# EAGLE design canSlaveV03_4s (EAGLE 6.3)

## Sheet 1 of 5
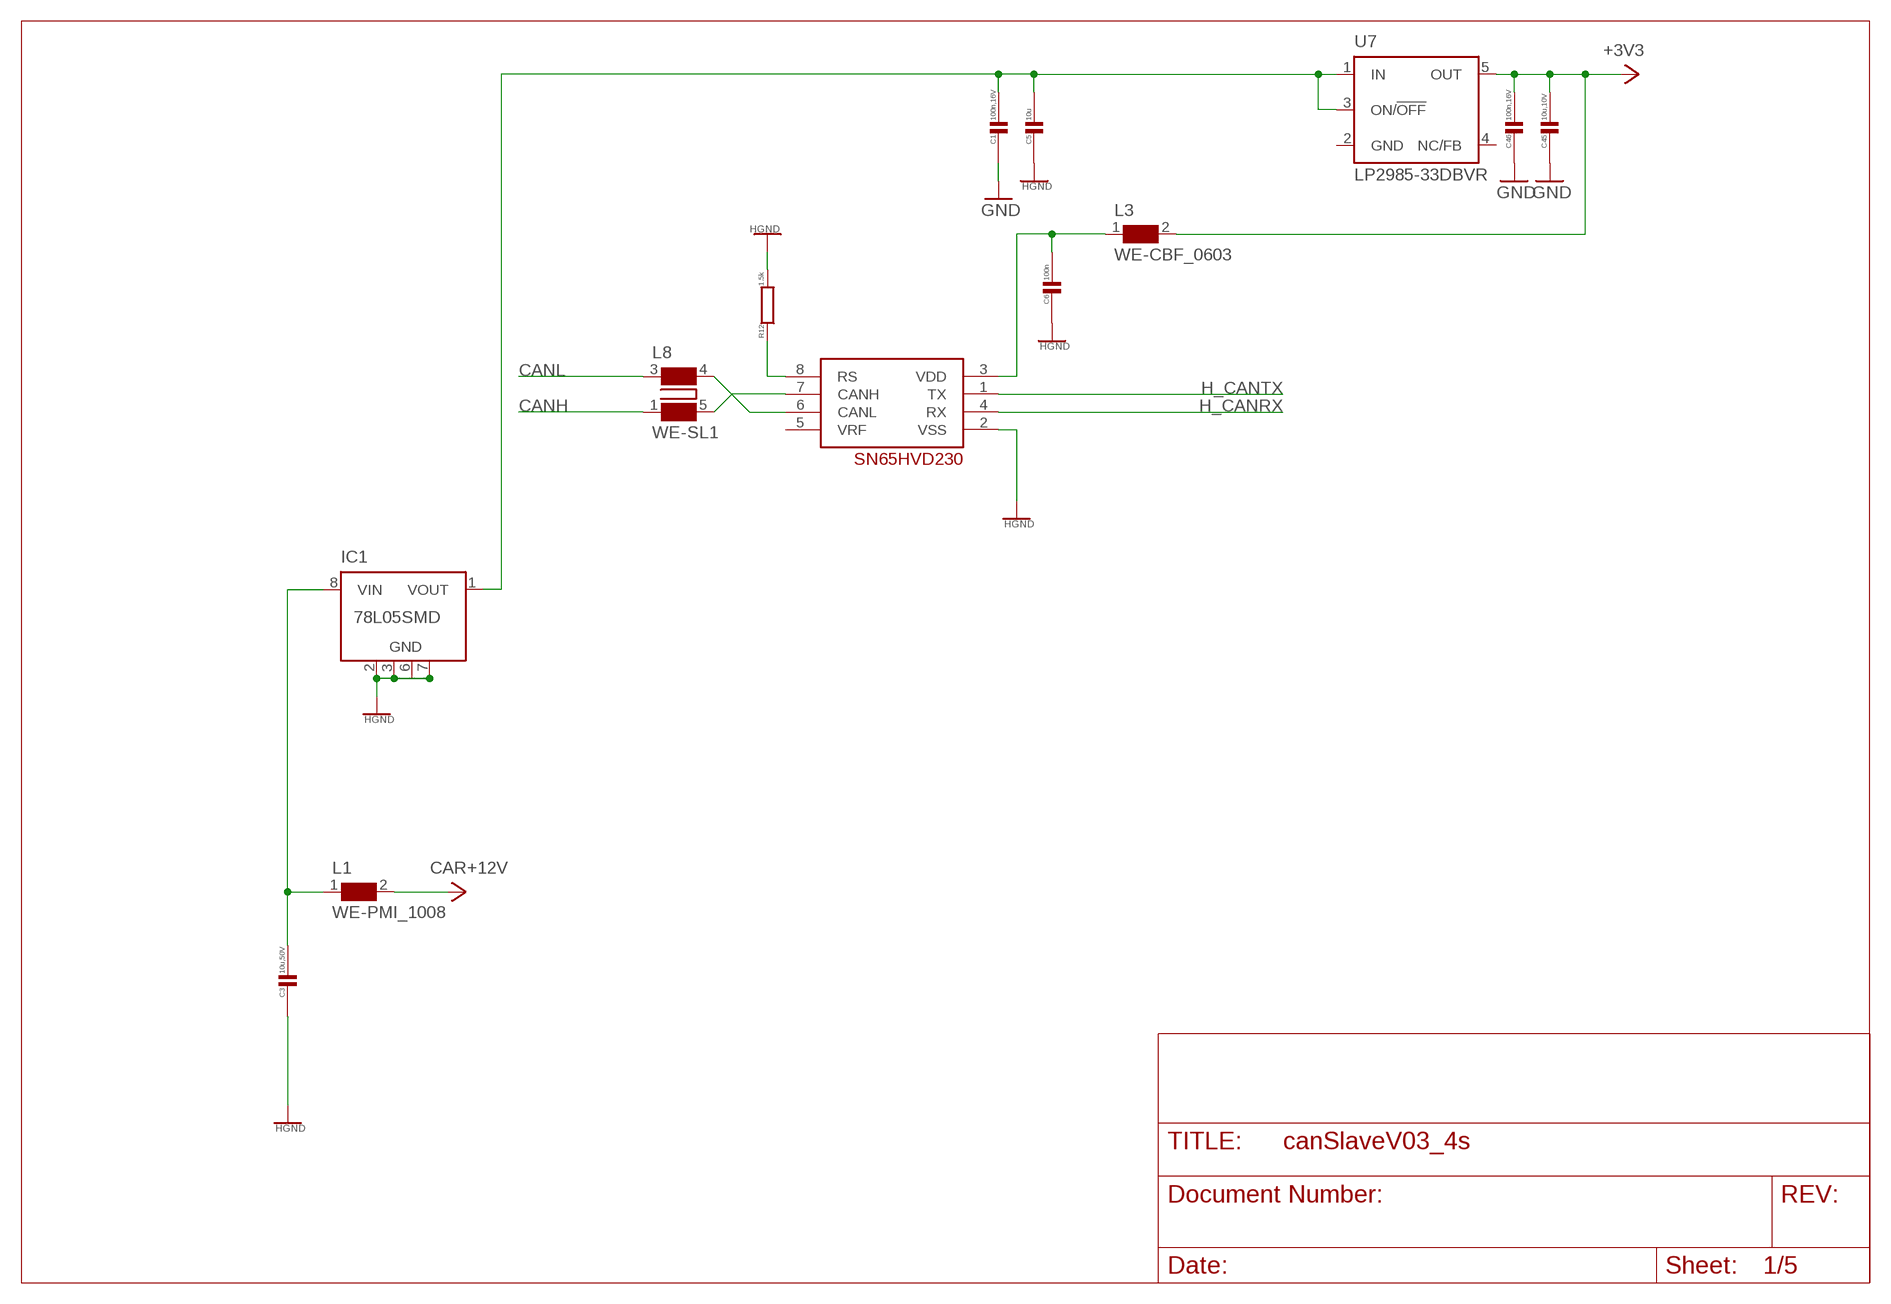
[diagram p0: schematic, sheet 1]

### Parts
C1  100n,16V  C0603  [C0603]
C3  10u,50V  C1206  [C1206]
C5  10u  C0603  [C0603]
C6  100n  C0603  [C0603]
C45  10u,10V  C0603  [C0603]
C46  100n,16V  C0603  [C0603]
IC1  78L05SMD  [SO08]
IC4  SN65HVD230  MCP2551  [SO-8]
L1  WE-PMI_1008  [WE-PMI_1008]
L3  WE-CBF_0603  [0603]
L8  WE-SL1  [WE-SL1]
R12  1.5k  R0603  [R0603]
U7  LP2985-33DBVR  LP2985-XXDBVR33  [SOT23-DBV]

### Nets
CANH: L8.1 ; also sheet 5
CANL: L8.3 ; also sheet 5
CAR+5V: C1.1 C5.1 IC1.1(VOUT) U7.1(IN) U7.3(ON/!OFF)
CAR+5V_H: C6.1 IC4.3(VDD) L3.1
CAR+12V: L1.2 ; also sheet 5
CAR+12VFILT: C3.1 IC1.8(VIN) L1.1
H+3V3: C45.1 C46.1 L3.2 U7.5(OUT) ; supply symbol labelled +3V3 ; also sheet 2,3,5
H_CANRX: IC4.4(RX) ; also sheet 2
H_CANTX: IC4.1(TX) ; also sheet 2
HCANHL: IC4.7(CANH) L8.5
HCANLL: IC4.6(CANL) L8.4
HGND: C1.2 C3.2 C5.2 C6.2 C45.2 C46.2 IC1.2(GND) IC1.3(GND) IC1.6(GND) IC1.7(GND) IC4.2(VSS) R12.2 ; supply symbol labelled GND ; also sheet 2,3,4,5
RS: IC4.8(RS) R12.1
Unconnected: IC1.4(NC) IC1.5(NC) IC4.5(VRF) U7.4(NC/FB)

## Sheet 2 of 5
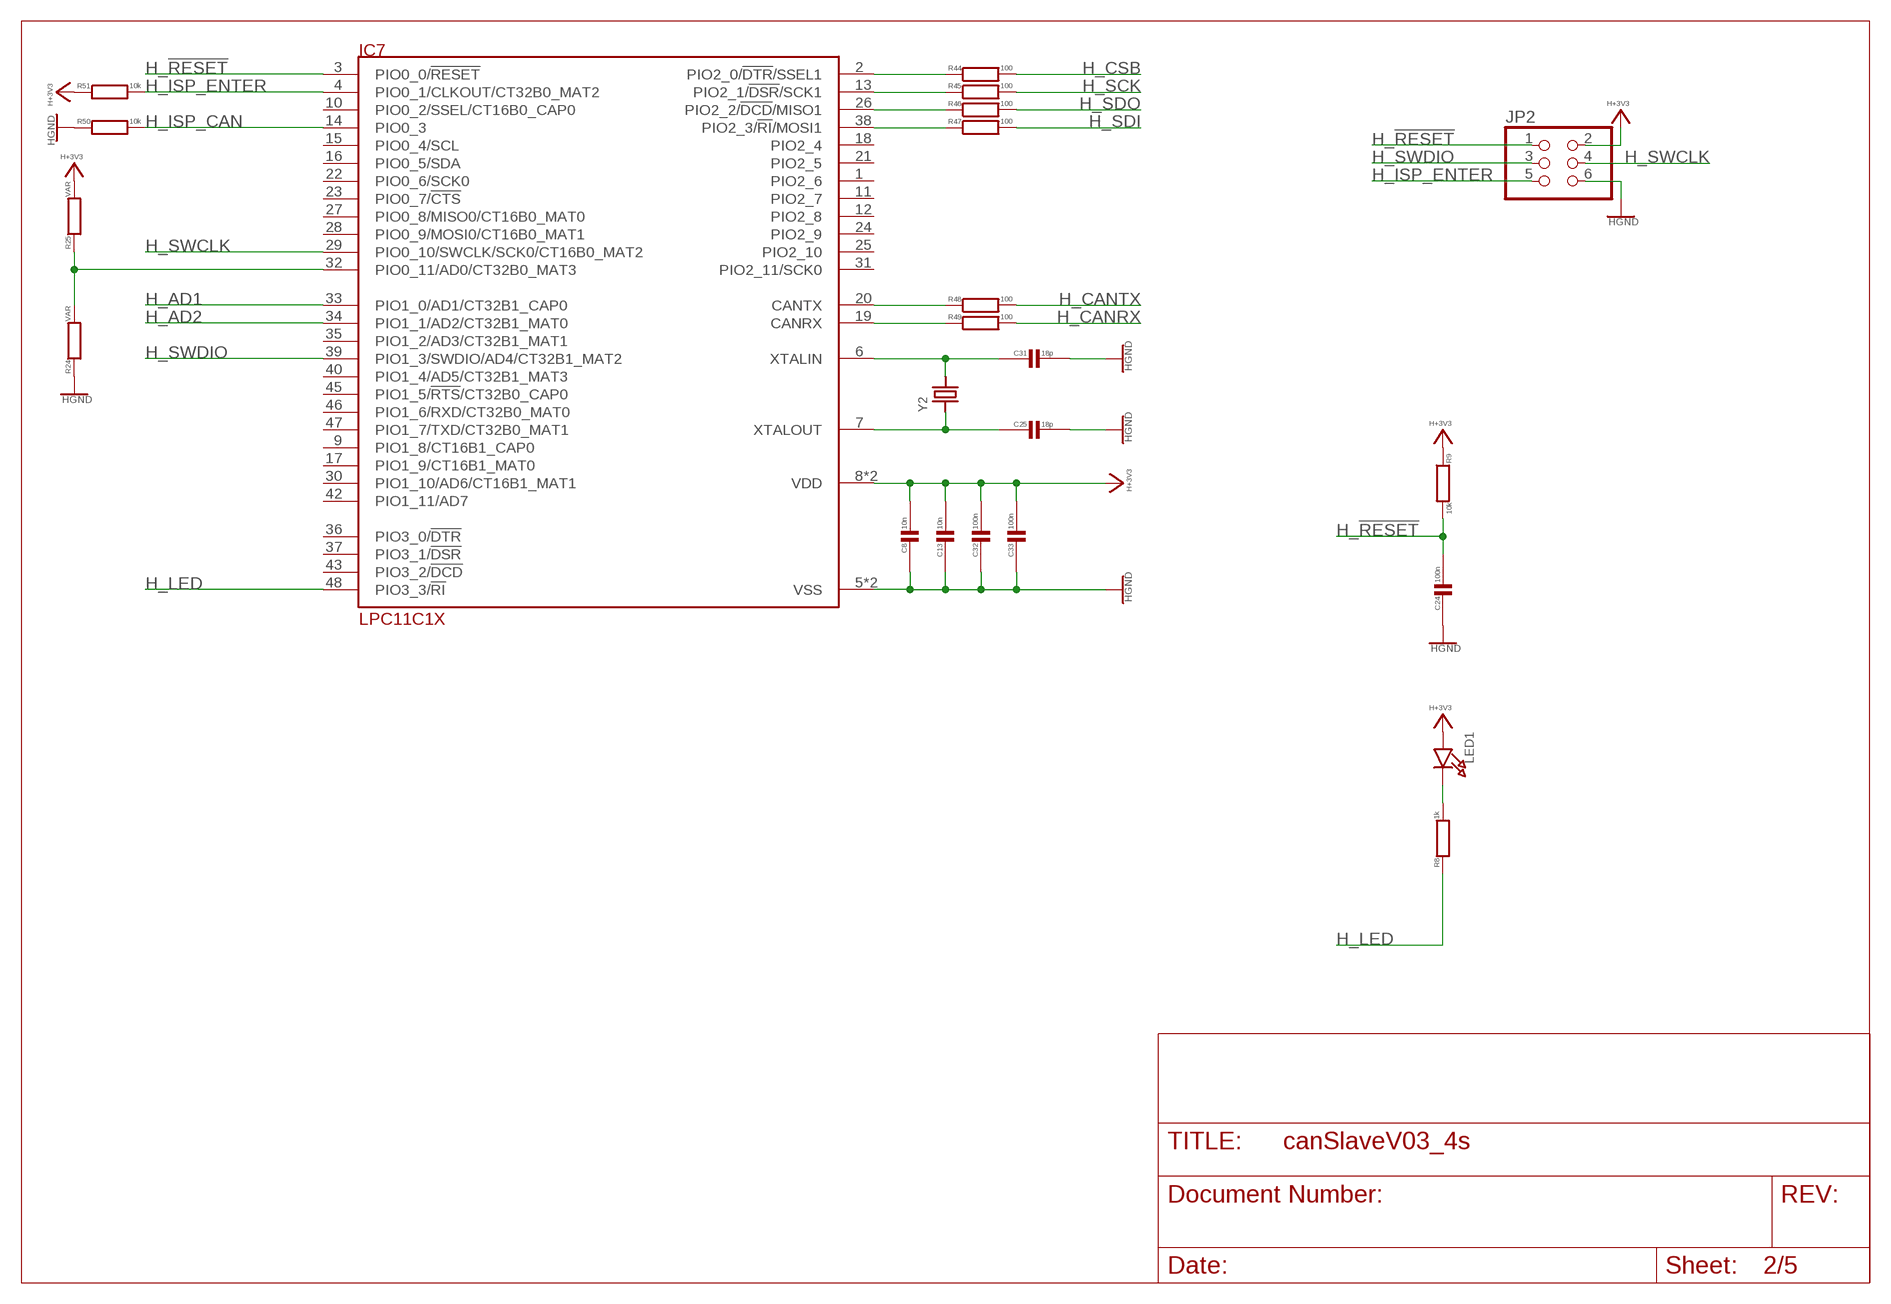
[diagram p1: schematic, sheet 2]

### Parts
C8  10n  C0603  [C0603]
C13  10n  C0603  [C0603]
C24  100n  C0603  [C0603]
C25  18p  C0603  [C0603]
C31  18p  C0603  [C0603]
C32  100n  C0603  [C0603]
C33  100n  C0603  [C0603]
IC7  LPC11C1X  [LQFP48]
JP2  HEADER-2X31.27  [2X03_1.27MM_SMT]
LED1  LED0603  [CHIPLED_0603]
R8  1k  R0603  [R0603]
R9  10k  R0603  [R0603]
R24  VAR  R0603  [R0603]
R25  VAR  R0603  [R0603]
R44  100  R0603  [R0603]
R45  100  R0603  [R0603]
R46  100  R0603  [R0603]
R47  100  R0603  [R0603]
R48  100  R0603  [R0603]
R49  100  R0603  [R0603]
R50  10k  R0603  [R0603]
R51  10k  R0603  [R0603]
Y2  CRYSTALTHIN  [CRYSTAL_3.2X2.5]

### Nets
CANRX_U_H: IC7.19(CANRX) R49.1
CANTX_U_H: IC7.20(CANTX) R48.1
H+3V3: C8.1 C13.1 C32.1 C33.1 IC7.8(VDD) IC7.44(VDD) JP2.2 LED1.A R9.1 R25.2 R51.1 ; also sheet 1,3,5
H_!RESET: C24.1 IC7.3(PIO0_0/!RESET) JP2.1 R9.2
H_AD1: IC7.33(PIO1_0/AD1/CT32B1_CAP0) ; also sheet 5
H_AD2: IC7.34(PIO1_1/AD2/CT32B1_MAT0)
H_ADR: IC7.32(PIO0_11/AD0/CT32B0_MAT3) R24.2 R25.1
H_CANRX: R49.2 ; also sheet 1
H_CANTX: R48.2 ; also sheet 1
H_CSB: R44.2 ; also sheet 3
H_ISP_CAN: IC7.14(PIO0_3) R50.2
H_ISP_ENTER: IC7.4(PIO0_1/CLKOUT/CT32B0_MAT2) JP2.5 R51.2
H_LED: IC7.48(PIO3_3/!RI) R8.1
H_MISO: IC7.26(PIO2_2/!DCD!/MISO1) R46.1
H_MOSI: IC7.38(PIO2_3/!RI!/MOSI1) R47.1
H_SCK: R45.2 ; also sheet 3
H_SCK1: IC7.13(PIO2_1/!DSR!/SCK1) R45.1
H_SDI: R47.2 ; also sheet 3
H_SDO: R46.2 ; also sheet 3
H_SSEL: IC7.2(PIO2_0/!DTR!/SSEL1) R44.1
H_SWCLK: IC7.29(PIO0_10/SWCLK/SCK0/CT16B0_MAT2) JP2.4
H_SWDIO: IC7.39(PIO1_3/SWDIO/AD4/CT32B1_MAT2) JP2.3
HGND: C8.2 C13.2 C24.2 C25.1 C31.1 C32.2 C33.2 IC7.5(VSS) IC7.41(VSS) JP2.6 R24.1 R50.1 ; also sheet 1,3,4,5
LED1C1: LED1.C R8.2
XTALIN1: C31.2 IC7.6(XTALIN) Y2.2
XTALOUT1: C25.2 IC7.7(XTALOUT) Y2.1
Unconnected: IC7.1(PIO2_6) IC7.9(PIO1_8/CT16B1_CAP0) IC7.10(PIO0_2/SSEL/CT16B0_CAP0) IC7.11(PIO2_7) IC7.12(PIO2_8) IC7.15(PIO0_4/SCL) IC7.16(PIO0_5/SDA) IC7.17(PIO1_9/CT16B1_MAT0) IC7.18(PIO2_4) IC7.21(PIO2_5) IC7.22(PIO0_6/SCK0) IC7.23(PIO0_7/!CTS) IC7.24(PIO2_9) IC7.25(PIO2_10) IC7.27(PIO0_8/MISO0/CT16B0_MAT0) IC7.28(PIO0_9/MOSI0/CT16B0_MAT1) IC7.30(PIO1_10/AD6/CT16B1_MAT1) IC7.31(PIO2_11/SCK0) IC7.35(PIO1_2/AD3/CT32B1_MAT1) IC7.36(PIO3_0/!DTR) IC7.37(PIO3_1/!DSR) IC7.40(PIO1_4/AD5/CT32B1_MAT3) IC7.42(PIO1_11/AD7) IC7.43(PIO3_2/!DCD) IC7.45(PIO1_5/!RTS!/CT32B0_CAP0) IC7.46(PIO1_6/RXD/CT32B0_MAT0) IC7.47(PIO1_7/TXD/CT32B0_MAT1)

## Sheet 3 of 5
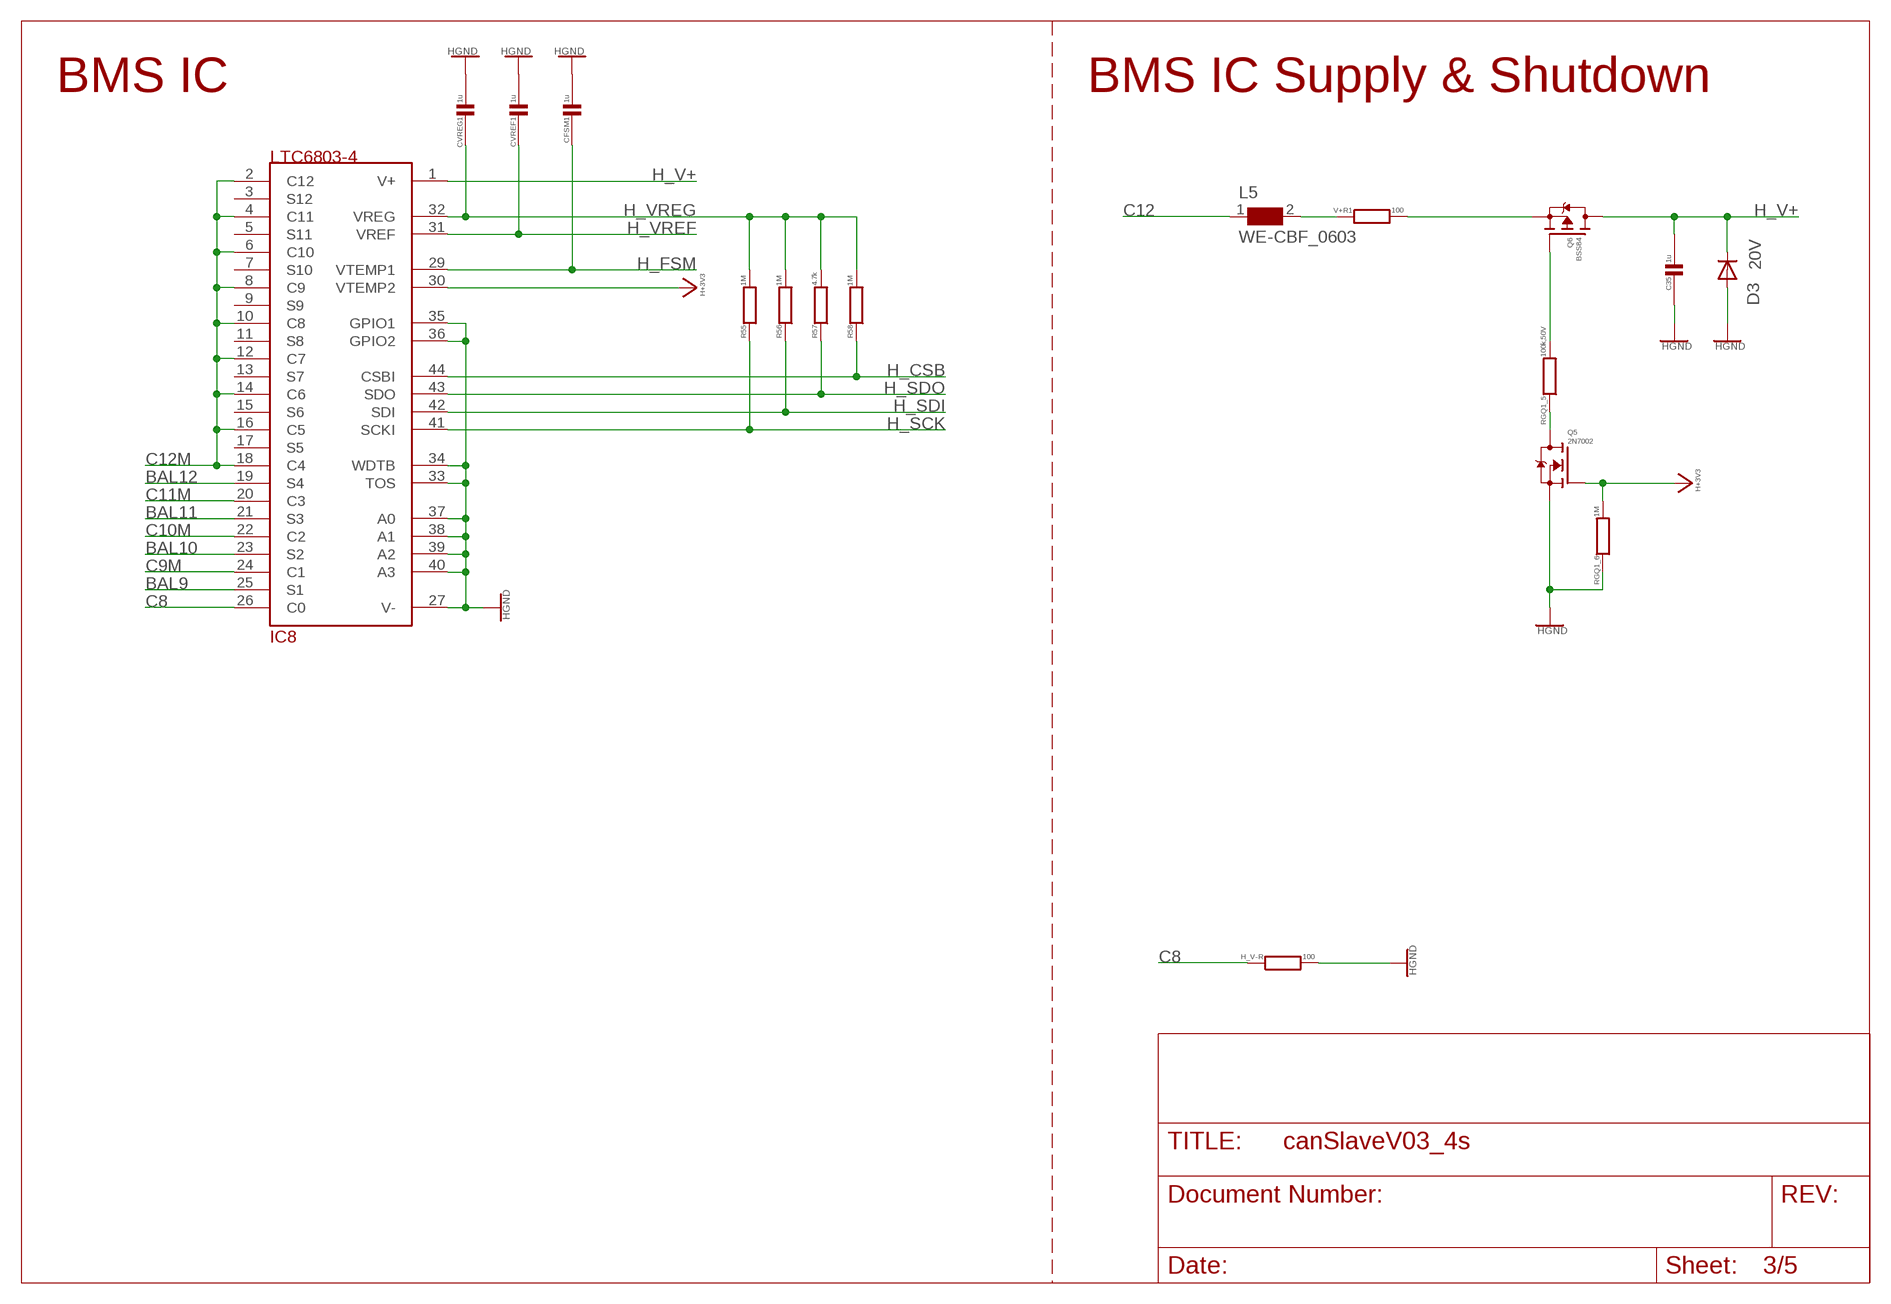
[diagram p2: schematic, sheet 3]

### Parts
C35  1u  C0603  [C0603]
CFSM1  1u  C0603  [C0603]
CVREF1  1u  C0603  [C0603]
CVREG1  1u  C0603  [C0603]
D3  20V  DIODE-SOD323-R  [SOD323-R]
H_V-R  100  R0603  [R0603]
IC8  LTC6803-4  [44SSOP]
L5  WE-CBF_0603  [0603]
Q5  2N7002  [SOT23]
Q6  BSS84  [SOT23]
R55  1M  R0603  [R0603]
R56  1M  R0603  [R0603]
R57  4.7k  R0603  [R0603]
R58  1M  R0603  [R0603]
RGQ1_5  100k,50V  R0603  [R0603]
RGQ1_6  1M  R0603  [R0603]
V+R1  100  R0603  [R0603]

### Nets
BAL9: IC8.25(S1) ; also sheet 4
BAL10: IC8.23(S2) ; also sheet 4
BAL11: IC8.21(S3) ; also sheet 4
BAL12: IC8.19(S4) ; also sheet 4
C8: H_V-R.1 IC8.26(C0) ; also sheet 4,5
C9M: IC8.24(C1) ; also sheet 4
C10M: IC8.22(C2) ; also sheet 4
C11M: IC8.20(C3) ; also sheet 4
C12: L5.1 ; also sheet 4,5
C12M: IC8.2(C12) IC8.4(C11) IC8.6(C10) IC8.8(C9) IC8.10(C8) IC8.12(C7) IC8.14(C6) IC8.16(C5) IC8.18(C4) ; also sheet 4
H+3V3: IC8.30(VTEMP2) Q5.1(G) RGQ1_6.2 ; also sheet 1,2,5
H_CSB: IC8.44(CSBI) R58.1 ; also sheet 2
H_FSM: CFSM1.2 IC8.29(VTEMP1) ; also sheet 5
H_SCK: IC8.41(SCKI) R55.1 ; also sheet 2
H_SDI: IC8.42(SDI) R56.1 ; also sheet 2
H_SDO: IC8.43(SDO) R57.1 ; also sheet 2
H_V+: C35.1 D3.C IC8.1(V+) Q6.3(D) ; also sheet 5
H_VREF: CVREF1.2 IC8.31(VREF)
H_VREG: CVREG1.2 IC8.32(VREG) R55.2 R56.2 R57.2 R58.2
HGND: C35.2 CFSM1.1 CVREF1.1 CVREG1.1 D3.A H_V-R.2 IC8.27(V-) IC8.33(TOS) IC8.34(WDTB) IC8.35(GPIO1) IC8.36(GPIO2) IC8.37(A0) IC8.38(A1) IC8.39(A2) IC8.40(A3) Q5.2(S) RGQ1_6.1 ; also sheet 1,2,4,5
N$5: Q5.3(D) RGQ1_5.1
N$6: L5.2 V+R1.1
Q1G1: Q6.1(G) RGQ1_5.2
V+S1: Q6.2(S) V+R1.2
Unconnected: IC8.3(S12) IC8.5(S11) IC8.7(S10) IC8.9(S9) IC8.11(S8) IC8.13(S7) IC8.15(S6) IC8.17(S5)

### Notes on the sheet
- BMS IC | BMS IC Supply & Shutdown

## Sheet 4 of 5
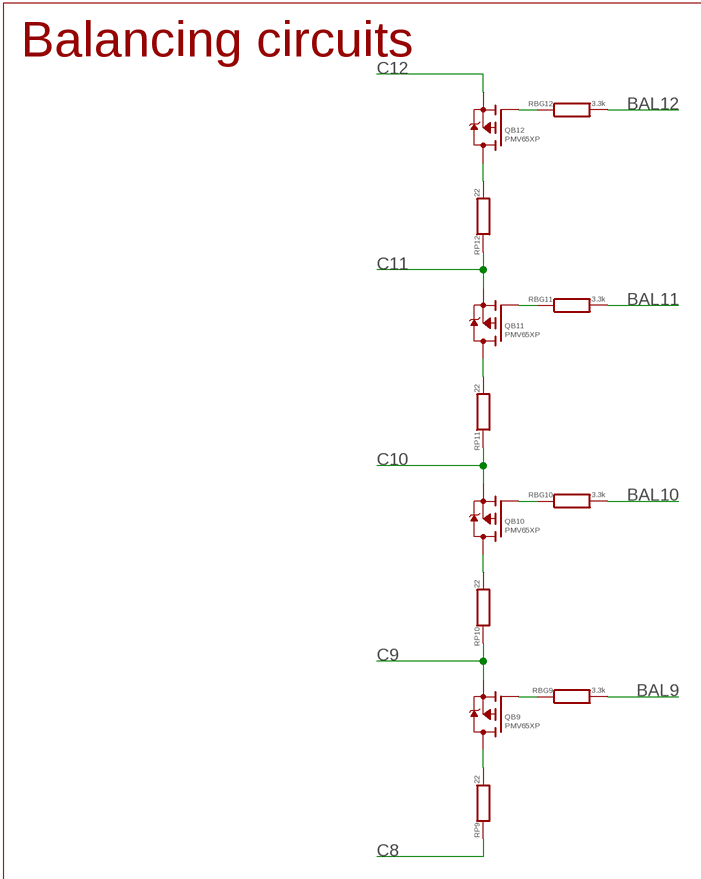
[diagram p3: schematic, sheet 4, part 1 of 2]
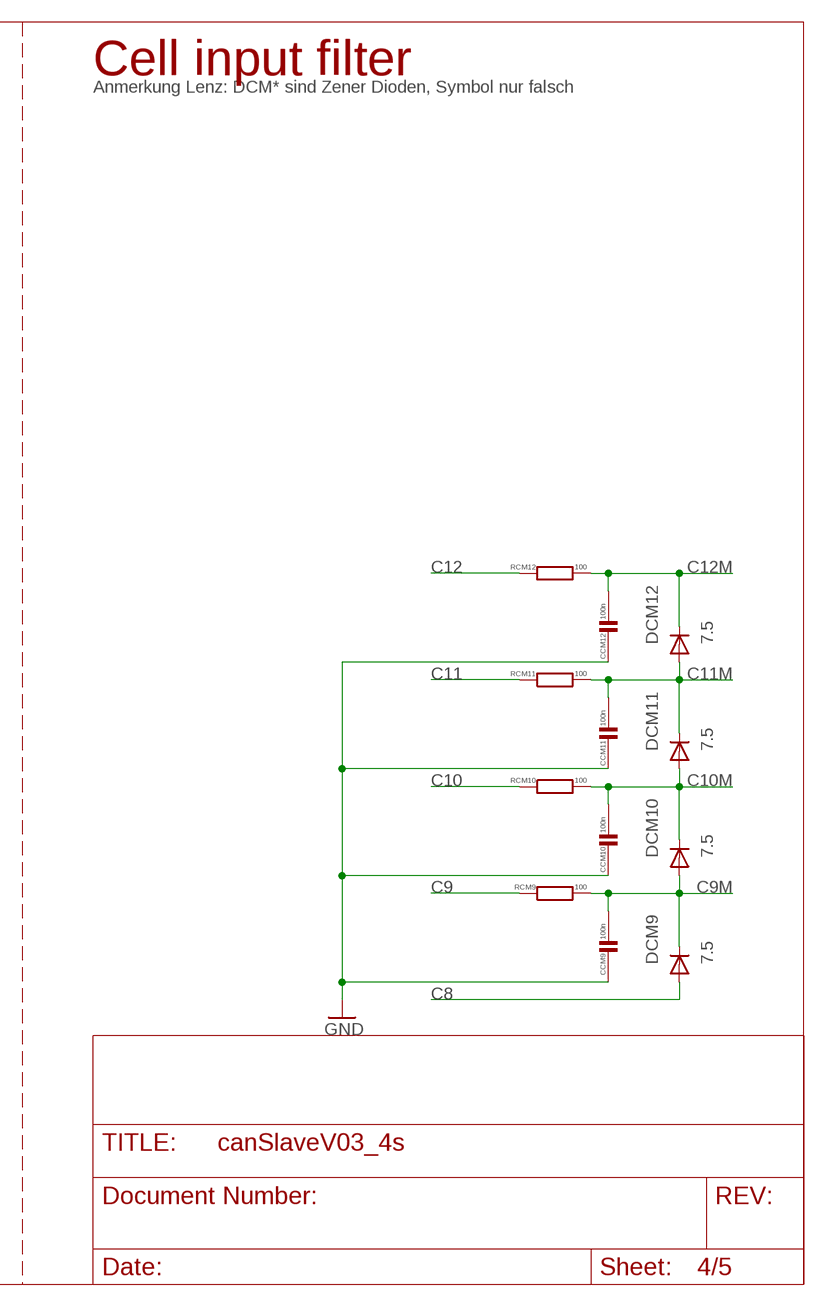
[diagram p4: schematic, sheet 4, part 2 of 2]

### Parts
CCM9  100n  C0603  [C0603]
CCM10  100n  C0603  [C0603]
CCM11  100n  C0603  [C0603]
CCM12  100n  C0603  [C0603]
DCM9  7.5  DIODE-SOD323-R  [SOD323-R]
DCM10  7.5  DIODE-SOD323-R  [SOD323-R]
DCM11  7.5  DIODE-SOD323-R  [SOD323-R]
DCM12  7.5  DIODE-SOD323-R  [SOD323-R]
QB9  PMV65XP  BSS84  [SOT23]
QB10  PMV65XP  BSS84  [SOT23]
QB11  PMV65XP  BSS84  [SOT23]
QB12  PMV65XP  BSS84  [SOT23]
RBG9  3.3k  R0603  [R0603]
RBG10  3.3k  R0603  [R0603]
RBG11  3.3k  R0603  [R0603]
RBG12  3.3k  R0603  [R0603]
RCM9  100  R0603  [R0603]
RCM10  100  R0603  [R0603]
RCM11  100  R0603  [R0603]
RCM12  100  R0603  [R0603]
RP9  22  R2512  [R2512]
RP10  22  R2512  [R2512]
RP11  22  R2512  [R2512]
RP12  22  R2512  [R2512]

### Nets
BAL9: RBG9.2 ; also sheet 3
BAL10: RBG10.2 ; also sheet 3
BAL11: RBG11.2 ; also sheet 3
BAL12: RBG12.2 ; also sheet 3
C8: DCM9.A RP9.1 ; also sheet 3,5
C9: QB9.2(S) RCM9.1 RP10.1 ; also sheet 5
C9M: CCM9.1 DCM9.C DCM10.A RCM9.2 ; also sheet 3
C10: QB10.2(S) RCM10.1 RP11.1 ; also sheet 5
C10M: CCM10.1 DCM10.C DCM11.A RCM10.2 ; also sheet 3
C11: QB11.2(S) RCM11.1 RP12.1 ; also sheet 5
C11M: CCM11.1 DCM11.C DCM12.A RCM11.2 ; also sheet 3
C12: QB12.2(S) RCM12.1 ; also sheet 3,5
C12M: CCM12.1 DCM12.C RCM12.2 ; also sheet 3
CR9: QB9.3(D) RP9.2
CR10: QB10.3(D) RP10.2
CR11: QB11.3(D) RP11.2
CR12: QB12.3(D) RP12.2
HGND: CCM9.2 CCM10.2 CCM11.2 CCM12.2 ; supply symbol labelled GND ; also sheet 1,2,3,5
QBG9: QB9.1(G) RBG9.1
QBG10: QB10.1(G) RBG10.1
QBG11: QB11.1(G) RBG11.1
QBG12: QB12.1(G) RBG12.1

### Notes on the sheet
- Balancing circuits | Cell input filter
- Anmerkung Lenz: DCM* sind Zener Dioden, Symbol nur falsch

## Sheet 5 of 5
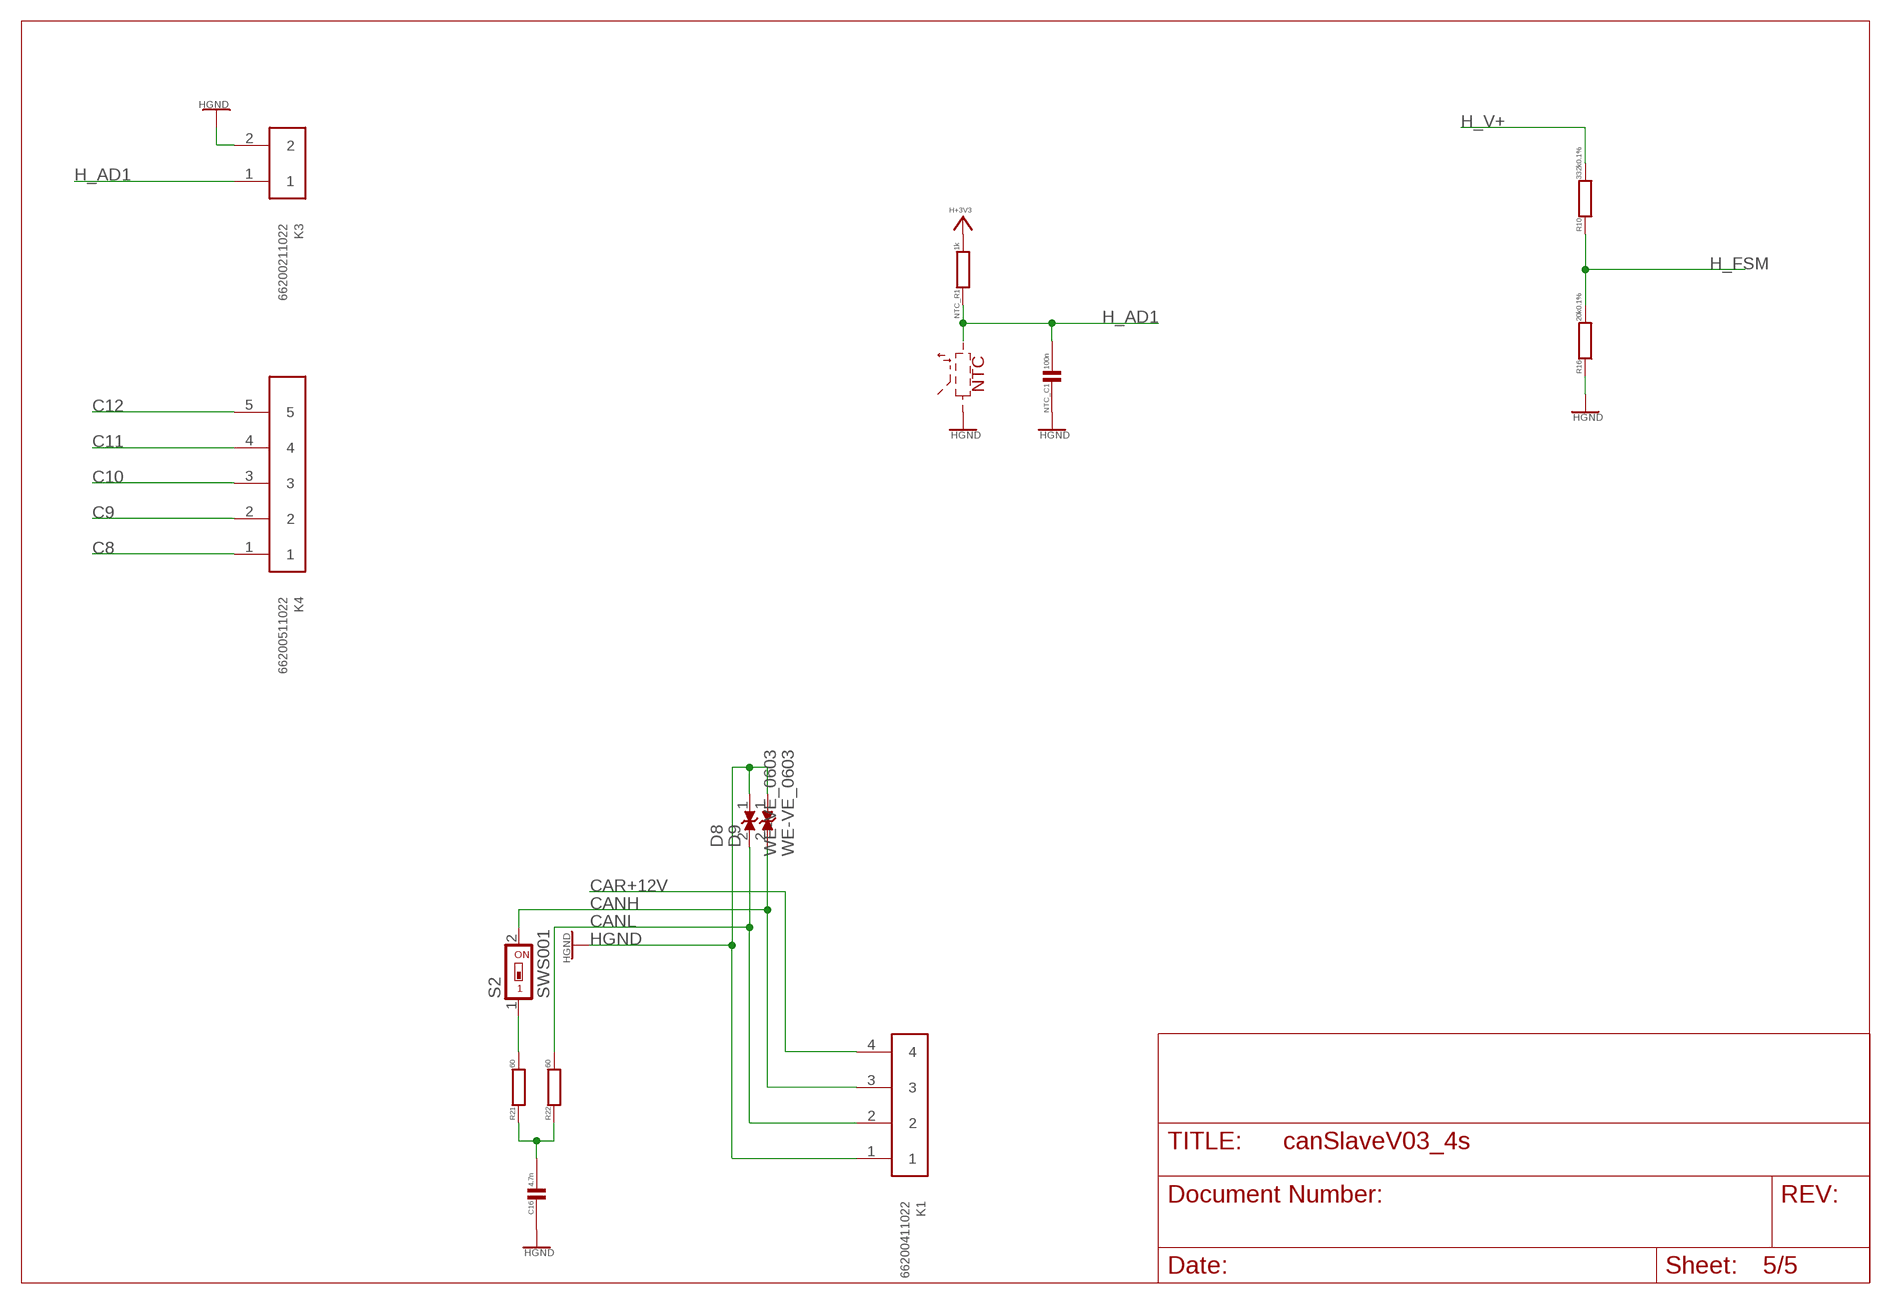
[diagram p5: schematic, sheet 5]

### Parts
C16  4.7n  C0603  [C0603]
D8  WE-VE_0603  [WESURGE_0603]
D9  WE-VE_0603  [WESURGE_0603]
K1  66200411022  [66200411022]
K3  66200211022  [66200211022]
K4  66200511022  [66200511022]
NTC_C1  100n  C0603  [C0603]
NTC_R1  1k  R0603  [R0603]
R10  332k0.1%  R0603  [R0603]
R16  20k0.1%  R0603  [R0603]
R21  60  R0603  [R0603]
R22  60  R0603  [R0603]
S2  SWS001  [SMS-001]

### Nets
C8: K4.1 ; also sheet 3,4
C9: K4.2 ; also sheet 4
C10: K4.3 ; also sheet 4
C11: K4.4 ; also sheet 4
C12: K4.5 ; also sheet 3,4
CANH: D9.2 K1.3 S2.2 ; also sheet 1
CANJ: R21.2 S2.1
CANL: D8.2 K1.2 R22.2 ; also sheet 1
CANT: C16.1 R21.1 R22.1
CAR+12V: K1.4 ; also sheet 1
H+3V3: NTC_R1.2 ; also sheet 1,2,3
H_AD1: K3.1 NTC_C1.1 NTC_R1.1 ; also sheet 2
H_FSM: R10.1 R16.2 ; also sheet 3
H_V+: R10.2 ; also sheet 3
HGND: C16.2 D8.1 D9.1 K1.1 K3.2 NTC_C1.2 R16.1 ; also sheet 1,2,3,4

### Notes on the sheet
- NTC

## Power pins joined to a net without a drawn wire
HGND: U7.2(GND)

## Library data of the parts
C1 C3 C5 C6 C8 C13 C16 C24 C25 C31-C33 C35 C45 C46 CCM9-CCM12 CFSM1 CVREF1 CVREG1 NTC_C1 = phrenetic:C
D3 DCM9-DCM12 = diode:DIODE-: DIODE
D8 D9 = EagleLibrary_Wuerth_Elektronik_eiSos_Version_6:WE-VE: WESURGE ESD Suppressor WE-VE - Fast response time - No leakage current - Low clamping voltage - Almost no energy consumption in stand-by mode - Excellent absorption for ESD-impulses - Designed to meet the EN 61000-4-2 standard - Nickel barrier - Operating temperature: -40°C to +85°C -- Protection of data lines -- Protection of bus system -- Protection of semiconductors -- ESD protection in accordance with EN 61000-4-2; 8 kV contact discharge / 15 kV air discharge
H_V-R NTC_R1 R8-R10 R12 R16 R21 R22 R24 R25 R44-R51 R55-R58 RBG9-RBG12 RCM9-RCM12 RGQ1_5 RGQ1_6 RP9-RP12 V+R1 = phrenetic:R: RESISTOR, Bla
IC1 = linear:78L*SMD: Positive VOLTAGE REGULATOR
IC4 = bms-hsrm:MCP2551
IC7 = phrenetic:LPC11C1X
IC8 = bms-hsrm:LTC6803-4
JP2 = microbuilder:HEADER-2X3: PIN HEADER
K1 = Wuerth_Elektronik_eiCan_08_Micro_Power_Connectors:66200411022: WR-MPC3 3.00mm Male Single Row Angled Header with Plastic Pegs, 4 Pins
K3 = Wuerth_Elektronik_eiCan_08_Micro_Power_Connectors:66200211022: WR-MPC3 3.00mm Male Single Row Angled Header with Plastic Pegs, 2 Pins
K4 = Wuerth_Elektronik_eiCan_08_Micro_Power_Connectors:66200511022: WR-MPC3 3.00mm Male Single Row Angled Header with Plastic Pegs, 5 Pins
L1 = EagleLibrary_Wuerth_Elektronik_eiSos_Version_6:WE-PMI: Power Multilayer Inductor WE-PMI - Compact multilayer type - Suitable for applocations with high currents up to 2.5 A - No crosstalk -- DC / DC converters especially at high switching frequencies -- Portable devices like PDA and digital cameras
L3 L5 = EagleLibrary_Wuerth_Elektronik_eiSos_Version_6:WE-CBF: SMD EMI Suppression Ferrite Beads WE-CBF - Excellent anti-EMI properties - Low DC-restistance - Impedances till 3000 ohms - Rated current up to 6 A -- Reliable Ni-Sn electrodes -- Perfect as data lined filter and for uncoupling of distribution voltage
L8 = EagleLibrary_Wuerth_Elektronik_eiSos_Version_6:WE-SL1: SMD Common Mode Line Filter WE-SL1 - Small size - Low Profile, only 1,65 mm - High Impedance up to 2000 ohm - High Current up to 300mA - Low leakage inductance -- USB -- CAN -- Firewire -- Data Lines -- Power Lines
LED1 = microbuilder:LED: LED 0603 - 0603 Surface Mount Package 2mA: Green LED - Low Power (3.9mcd, 2ma, 1.7Vf) - Digikey: 475-2709-2-ND Orange LED - Low Power (9.8mcd, 2ma, 1.8Vf) - Digikey: 475-1194-2-ND Red LED - Low Power (5mcd, 2ma, 1.8Vf) - Digikey: 475-1195-2-ND Yellow LED - Low Power (7mcd, 2ma, 1.8Vf) - Digikey: 475-1196-2-ND 5mA: Blue LED - Low Power (17mcd, 5ma, 2.9Vf) - Digikey: LNJ937W8CRACT-ND 0805 - 0805 Surface Mount Package 2mA: Red LED (8.8mcd, 2mA, 1.8Vf, Clear) - Low Power [Digikey: 475-2510-1-ND] Green LED (5mcd, 2mA, 1.8Vf, Clear) - Low Power [Digikey: 475-2730-1-ND] Yellow LED (11.3mcd, 2mA, 1.8Vf, Clear) - Low Power [Digikey: 475-2555-1-ND] 20mA: Red LED (104mcd, 20mA, Diffused) - LS R976 [Digikey: 475-1278-6-ND] Red LED (12mcd, 20mA, 2.0Vf, Clear) - APT2012EC [Digikey: 754-1128-1-ND] Green LED (15mcd, 20mA, 2.2Vf, Clear) - APT2012GC [Digikey: 754-1131-1-ND] Orange LED (160mcd, 20mA, 2.1Vf, Clear) - APT2012SECK [Digikey: 754-1130-1-ND] 1206 - 1206 Surface Mount Package Green LED (26mcd, 20mA, Diffused) - LG N971 [Digikey: 475-1407-6-ND] Red LED (15mcd, 20mA, Diffused) - LH N974 [Digikey: 475-1416-6-ND]
Q5 = phrenetic:2N7002
Q6 QB9-QB12 = phrenetic:BSS84
S2 = smd-special:SWS001: SMD Dip Switch 1 pol.
U7 = SmartPrj:LP2985-XXDBVR: ULTRALOW-POWER 50-mA LOW-DROPOUT LINEAR REGULATORS 50-mA Low-Dropout Regulator Source: http://focus.ti.com/lit/ds/symlink/tps77001.pdf
Y2 = microbuilder:CRYSTAL: Crystals HC49UP - Surface Mount Crystal 4.0MHz 18pF +/-30ppm Surface Mount Crystal [Digikey: 535-9857-1-ND] 12.0 MHz Surface Mount Crystal [Digikey: 535-9869-6-ND] 25.0 MHz Surface Mount Crystal [Digikey: 535-9078-1-ND] 2.5 x 2.0mm - MEMs SMT Crystal 16.0 MHz 10pF 20ppm 2.5 x 2.0mm Crystal [Digikey -40-85°C: 535-10923-1-ND] 3.2 x 2.5mm - MEMs SMT Crystal 12.0 MHz 8pF 15ppm 3.2 x 2.5mm Crystal [Digikey: -10-70°C: 644-1047-1-ND -40-125°C: 644-1128-1-ND] 16.0 MHz 8pF 15ppm 3.2 x 2.5mm Crystal [Digikey: -10-70°C: 644-1049-1-ND -40-125°C: 644-1129-2-ND] 16.0 MHz 10pF 10ppm 3.2 x 2.5mm Crystal [Digikey: 644-1100-1-ND] 27.12 MHz 18pF 30ppm 3.2 x 2.5mm Crystal [Digikey: 887-1424-1-ND] 27.12MHz 10pF 10ppm 3.2 x 2.5mm Crystal [Digikey: 887-1329-1-ND] 4.9 x 1.8mm - MEMs SMT Crystal 32.768 KHz 12.5pF 20ppm 4.9 x 1.8mm Crystal [Digikey: SE2415CT-ND] 8.0 x 3.8mm - Surface Mount Crystal 32.768kHz 12.5pF 20ppm -40°C-85°C [Digikey: 535-9166-2-ND] Cylinder 32.768KHz Cylinder Crystal (2x6mm body) [Ex. Digikey: 300-8341-2-ND]

## Board
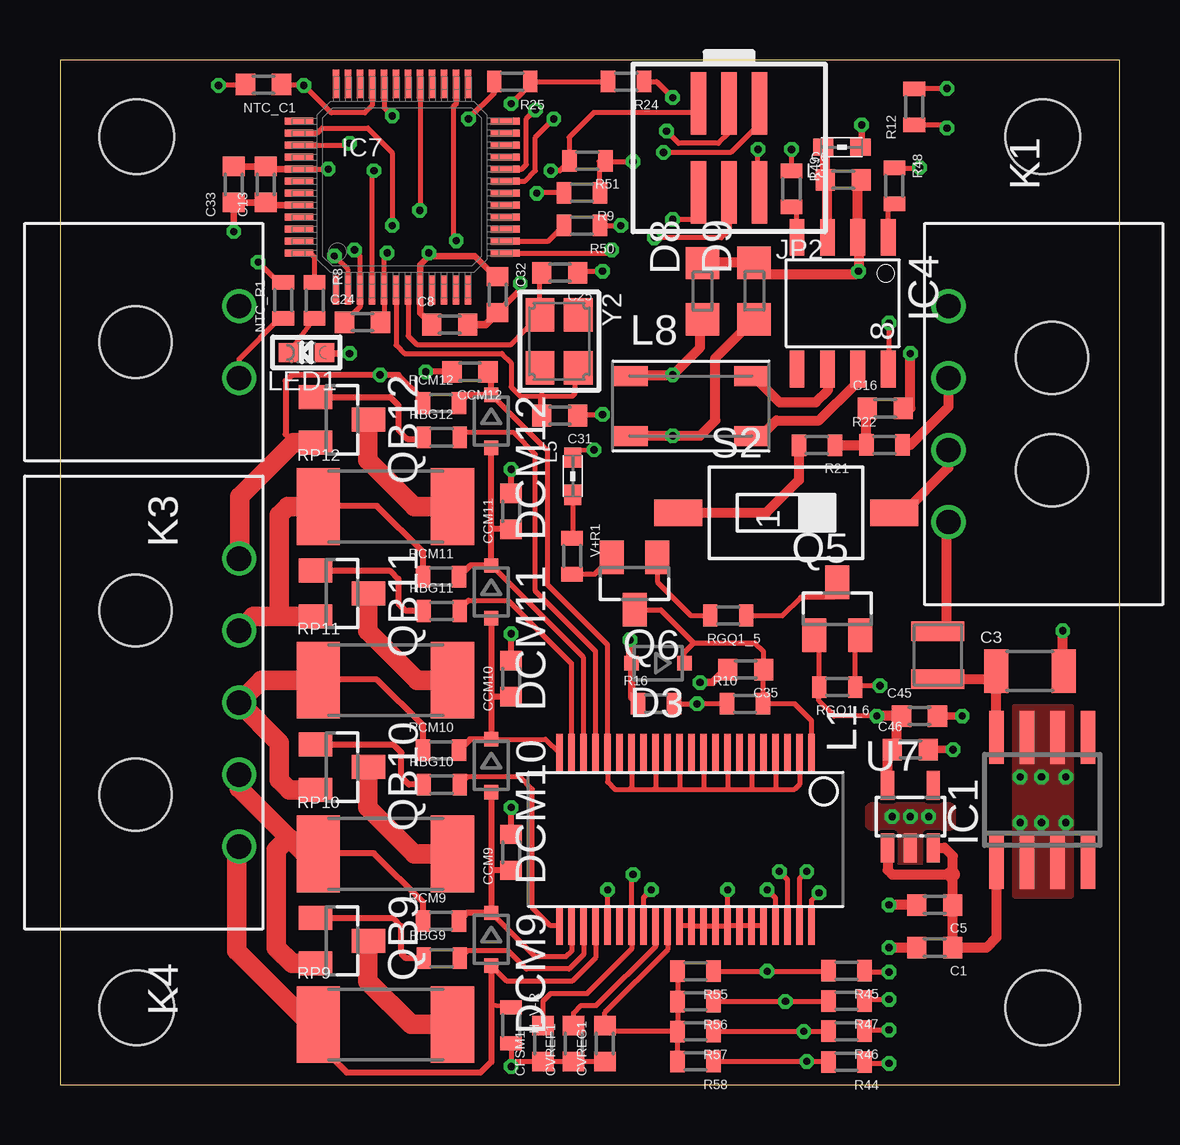
[diagram p6: board, top side]
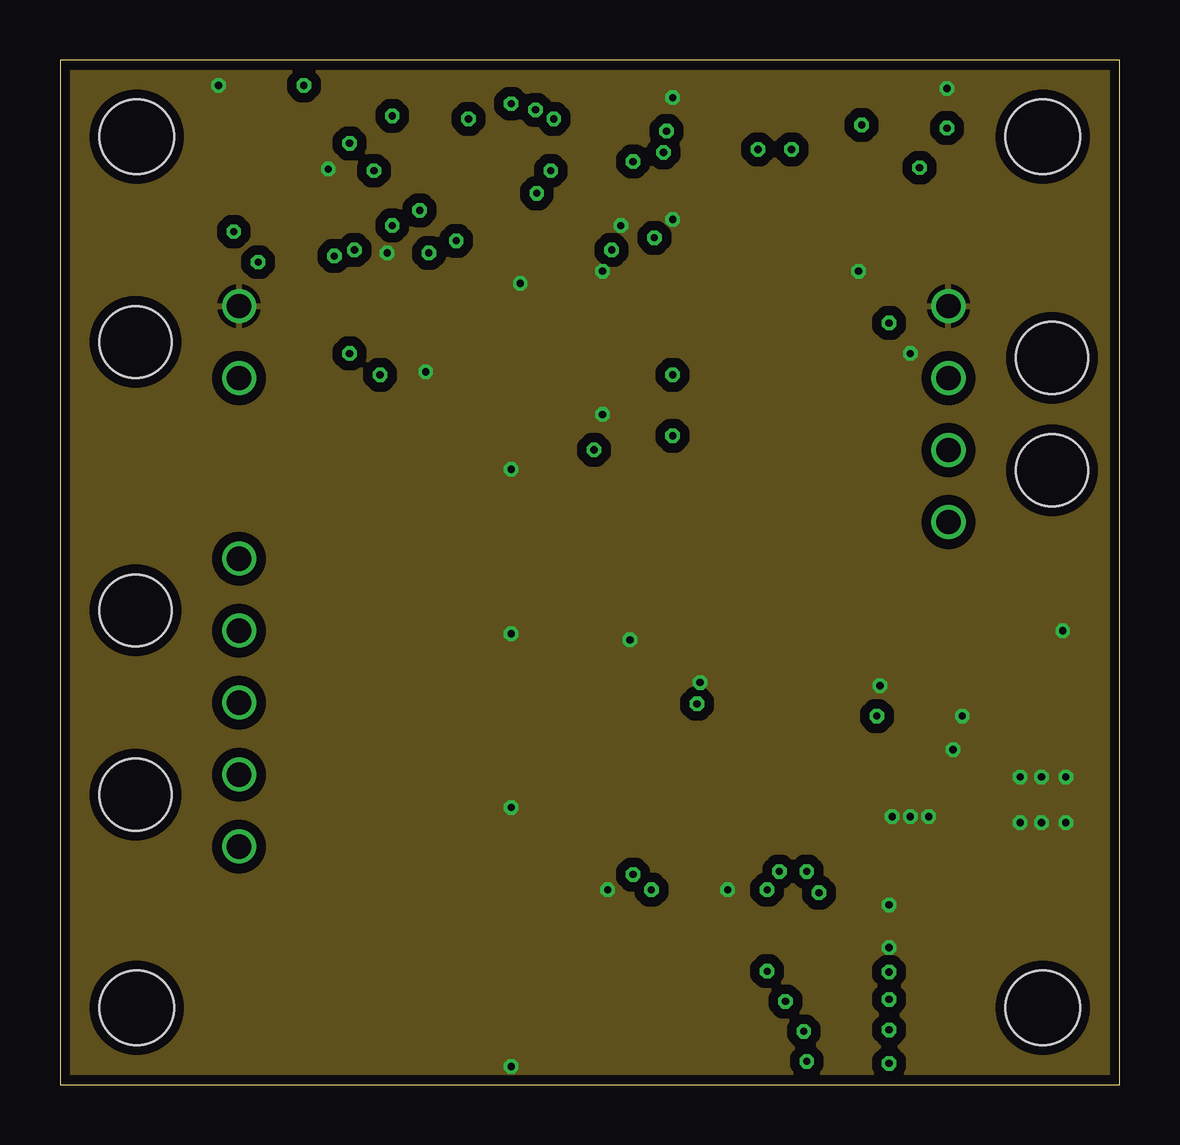
[diagram p7: board, inner layer Route2]
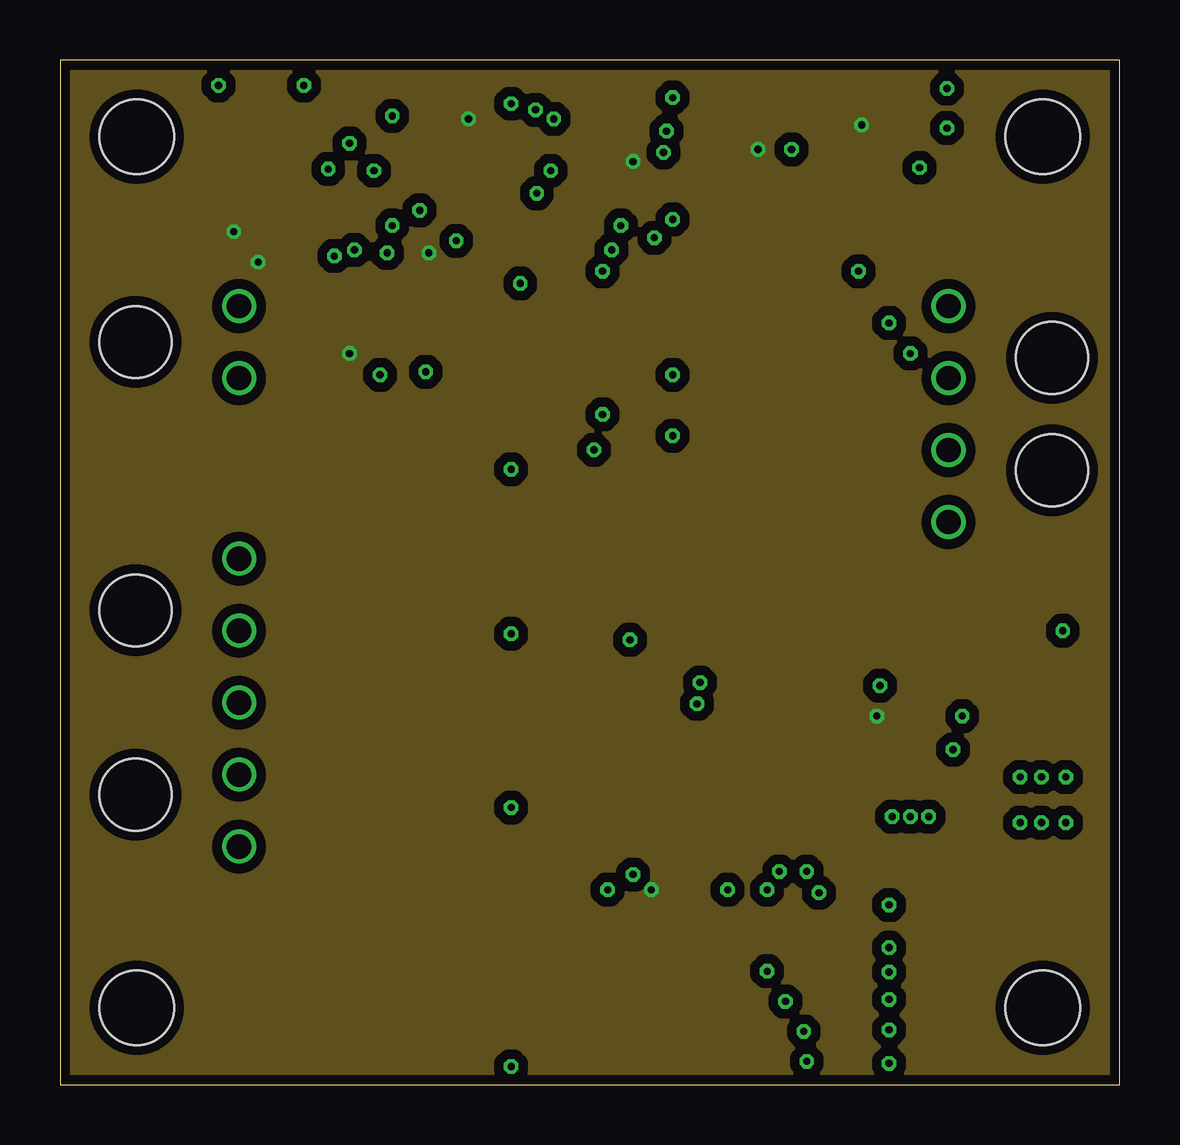
[diagram p8: board, inner layer Route15]
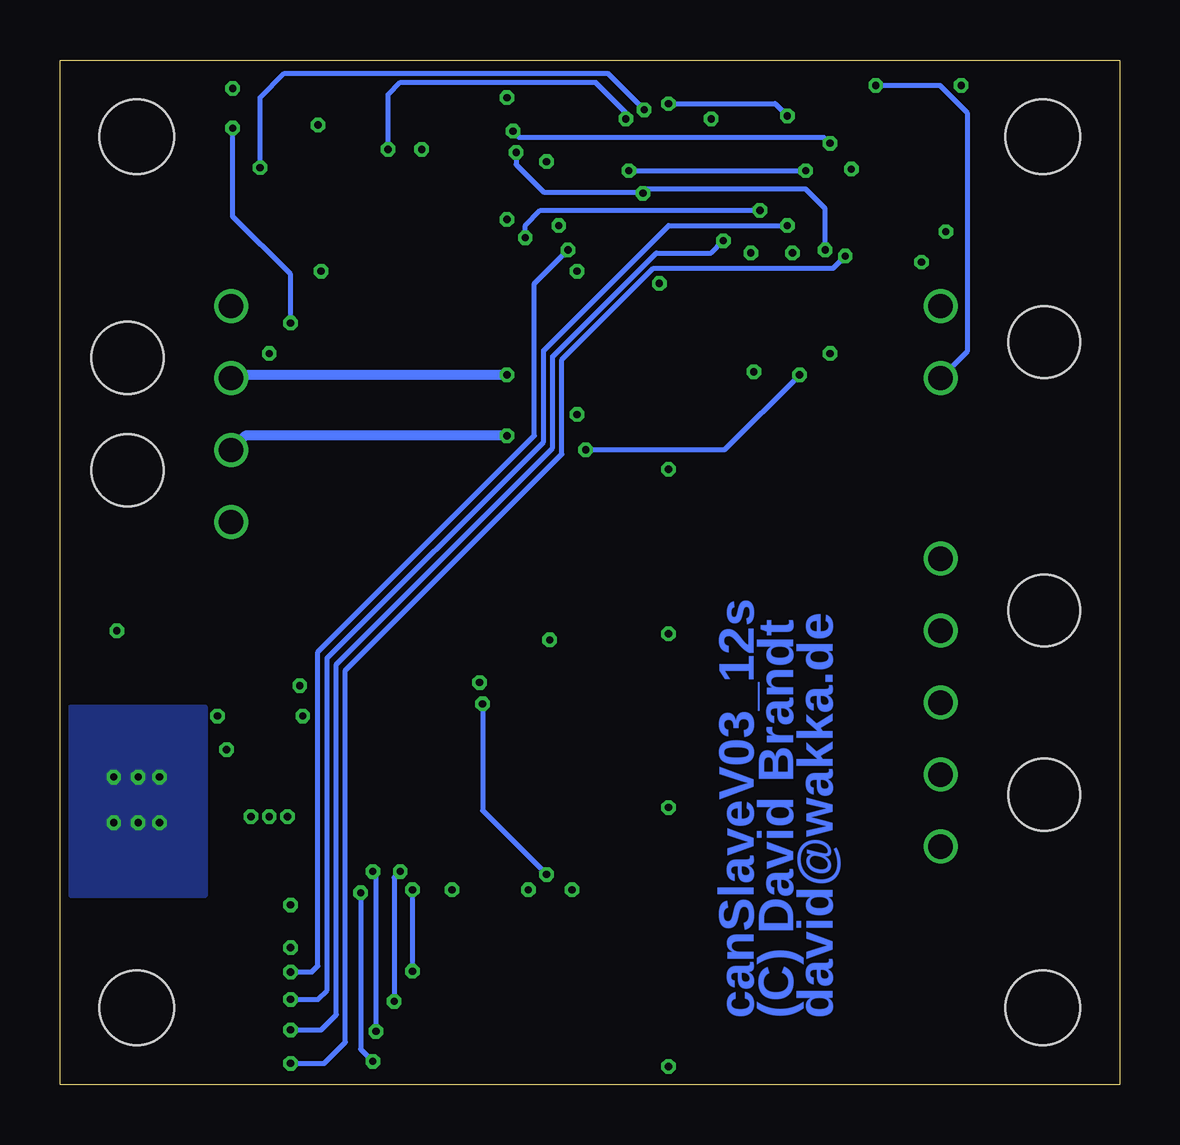
[diagram p9: board, bottom side, seen from below]

Size 44.15 x 42.72 mm. Coordinates in mm from the lower left corner, seen from the top.
Outline: 0,0 44.15,0 44.15,42.72 0,42.72 0,0
Copper layers (1+2*15+16): Top 0.035mm / dielectric 0.38mm / Route2 0.035mm / dielectric 0.71mm / Route15 0.035mm / dielectric 0.38mm / Bottom 0.035mm
Design rules "PCB-POOL Standard_ML4 *": minimum track width 8mil, minimum drill 0.3mm, track to track 0.15mm, track to pad 0.15mm, pad to pad 0.15mm, via to via 0.15mm, smd to smd 0.15mm, copper to edge 0.3mm, drill to drill 0.2mm, minimum pad ring 0.2mm, minimum via ring 0.15mm, stop-mask expansion 0.075mm, vias tented up to drill 0.41mm, thermal gap 0.2mm
Holes 3.1 mm at 3.2,3.2 3.2,39.52 40.95,3.2 40.95,39.52
tRestrict: area 0.2,0.2 to 6.2,6.2; area 0.2,36.5 to 6.2,42.5; area 38,0.2 to 44,6.2; area 38,36.5 to 44,42.5
bRestrict: area 0.2,0.2 to 6.2,6.2; area 0.2,36.5 to 6.2,42.5; area 38,0.2 to 44,6.2; area 38,36.5 to 44,42.5

### Footprints (pad centres in the part's own frame; a part is rotated, then mirrored left to right if it is on the bottom)
C0603 = smd 0.8 x 0.9: 1 -0.75,0; 2 0.75,0
C1206 = smd 1 x 1.8: 1 -1.4,0; 2 1.4,0
SOD323-R = smd 0.6 x 0.6: A 1.1,0; C -1.1,0
WESURGE_0603 = smd 1.35 x 1.4: 1 -1.175,0; 2 1.175,0
R0603 = smd 0.6 x 0.9: 1 -0.75,0; 2 0.75,0
SO08 = smd 0.6 x 2.2: 1 -1.905,-2.6; 2 -0.635,-2.6; 3 0.635,-2.6; 4 1.905,-2.6; 5 1.905,2.6; 6 0.635,2.6; 7 -0.635,2.6; 8 -1.905,2.6
SO-8 = smd 1.524 x 0.61: 1 -2.743,1.905; 2 -2.743,0.635; 3 -2.743,-0.635; 4 -2.743,-1.905; 5 2.743,-1.905; 6 2.743,-0.635; 7 2.743,0.635; 8 2.743,1.905
LQFP48 = smd 0.28 x 1.2: 1 -2.75,-4.3; 2 -2.25,-4.3; 3 -1.75,-4.3; 4 -1.25,-4.3; 5 -0.75,-4.3; 6 -0.25,-4.3; 7 0.25,-4.3; 8 0.75,-4.3; 9 1.25,-4.3; 10 1.75,-4.3; 11 2.25,-4.3; 12 2.75,-4.3; 25 2.75,4.3; 26 2.25,4.3; 27 1.75,4.3; 28 1.25,4.3; 29 0.75,4.3; 30 0.25,4.3; 31 -0.25,4.3; 32 -0.75,4.3; 33 -1.25,4.3; 34 -1.75,4.3; 35 -2.25,4.3; 36 -2.75,4.3 | smd 1.2 x 0.28: 13 4.3,-2.75; 14 4.3,-2.25; 15 4.3,-1.75; 16 4.3,-1.25; 17 4.3,-0.75; 18 4.3,-0.25; 19 4.3,0.25; 20 4.3,0.75; 21 4.3,1.25; 22 4.3,1.75; 23 4.3,2.25; 24 4.3,2.75; 37 -4.3,2.75; 38 -4.3,2.25; 39 -4.3,1.75; 40 -4.3,1.25; 41 -4.3,0.75; 42 -4.3,0.25; 43 -4.3,-0.25; 44 -4.3,-0.75; 45 -4.3,-1.25; 46 -4.3,-1.75; 47 -4.3,-2.25; 48 -4.3,-2.75
44SSOP = smd 1.6 x 0.28: 1 -3.6,5.25; 2 -3.6,4.75; 3 -3.6,4.25; 4 -3.6,3.75; 5 -3.6,3.25; 6 -3.6,2.75; 7 -3.6,2.25; 8 -3.6,1.75; 9 -3.6,1.25; 10 -3.6,0.75; 11 -3.6,0.25; 12 -3.6,-0.25; 13 -3.6,-0.75; 14 -3.6,-1.25; 15 -3.6,-1.75; 16 -3.6,-2.25; 17 -3.6,-2.75; 18 -3.6,-3.25; 19 -3.6,-3.75; 20 -3.6,-4.25; 21 -3.6,-4.75; 22 -3.6,-5.25; 23 3.6,-5.25; 24 3.6,-4.75; 25 3.6,-4.25; 26 3.6,-3.75; 27 3.6,-3.25; 28 3.6,-2.75; 29 3.6,-2.25; 30 3.6,-1.75; 31 3.6,-1.25; 32 3.6,-0.75; 33 3.6,-0.25; 34 3.6,0.25; 35 3.6,0.75; 36 3.6,1.25; 37 3.6,1.75; 38 3.6,2.25; 39 3.6,2.75; 40 3.6,3.25; 41 3.6,3.75; 42 3.6,4.25; 43 3.6,4.75; 44 3.6,5.25
2X03_1.27MM_SMT = smd 0.65 x 2.6: 1 -1.27,-1.85; 2 -1.27,1.85; 3 0,-1.85; 4 0,1.85; 5 1.27,-1.85; 6 1.27,1.85
66200411022 = drill 1.02: 1 1.5,0; 2 -1.5,0; 3 -4.5,0; 4 -7.5,0 | hole 3: -0.66,-4.32; -5.34,-4.32
66200211022 = drill 1.02: 1 1.5,0; 2 -1.5,0 | hole 3: 0,-4.32
66200511022 = drill 1.02: 1 1.5,0; 2 -1.5,0; 3 -4.5,0; 4 -7.5,0; 5 -10.5,0 | hole 3: -0.66,-4.32; -8.34,-4.32
WE-PMI_1008 = smd 0.8 x 2.2: 1 -1,0; 2 1,0
0603 = smd 0.85 x 0.7: 1 -0.775,0; 2 0.775,0
WE-SL1 = smd 1.5 x 0.85: 1 -2.55,-1.25; 3 -2.55,1.25; 4 2.55,1.25; 5 2.55,-1.25
CHIPLED_0603 = smd 0.8 x 0.8: A 0,-0.75; C 0,0.75
SOT23 = smd 1 x 1.4: 1 -0.95,-1.1; 2 0.95,-1.1; 3 0,1.1
R2512 = smd 1.8 x 3.2: 1 -2.8,0; 2 2.8,0
SMS-001 = smd 1.092 x 2.007: 1 0,-4.496; 2 0,4.496
SOT23-DBV = smd 0.55 x 1.2: 1 -0.95,-1.3; 2 0,-1.3; 3 0.95,-1.3; 4 0.95,1.3; 5 -0.95,1.3
CRYSTAL_3.2X2.5 = smd 1.4 x 1.2: 1 -1.1,-0.8; 2 1.1,0.8; GND1 -1.1,0.8; GND2 1.1,-0.8

### Placement (x,y rotation side)
C1  36.45,5.71 180 top
C3  40.42,17.24 0 top
C5  36.45,7.49 180 top
C6  32.64,37.72 0 top
C8  16.24,31.69 0 top
C13  8.57,37.53 90 top
C16  34.39,28.19 0 top
C24  12.6,31.78 0 top
C25  20.83,33.85 180 top
C31  20.83,27.89 180 top
C32  18.24,32.93 270 top
C33  7.24,37.53 90 top
C35  28.57,17.3 180 top
C45  35.81,15.37 0 top
C46  35.43,13.97 0 top
CCM9  18.8,9.68 90 top
CCM10  18.8,16.92 90 top
CCM11  18.8,23.91 90 top
CCM12  17.08,29.72 180 top
CFSM1  20.13,1.71 90 top
CVREF1  21.4,1.71 90 top
CVREG1  22.7,1.71 90 top
D3  24.92,17.57 180 top
D8  26.77,33.07 270 top
D9  28.92,33.08 270 top
DCM9  17.97,6.06 270 top
DCM10  17.97,13.3 270 top
DCM11  17.97,20.54 270 top
DCM12  17.97,27.65 270 top
H_V-R  18.8,2.48 270 top
IC1  40.93,11.87 0 top
IC4  32.61,32.58 270 top
IC7  14.26,37.42 0 top
IC8  26.07,10.22 270 top
JP2  27.88,39.05 180 top
K1  37.02,30.96 90 top
K3  7.46,30.96 270 top
K4  7.46,11.43 270 top
L1  36.58,17.91 90 top
L3  32.58,39.08 0 top
L5  21.37,25.37 270 top
L8  26.29,28.29 0 top
LED1  10.27,30.52 90 top
NTC_C1  8.48,41.69 180 top
NTC_R1  9.3,32.7 90 top
Q5  32.38,19.84 0 top
Q6  23.94,20.89 180 top
QB9  11.75,6 270 top
QB10  11.75,13.24 270 top
QB11  11.75,20.48 270 top
QB12  11.75,27.72 270 top
R8  10.61,32.7 270 top
R9  21.75,37.18 180 top
R10  28.54,15.88 0 top
R12  35.59,40.76 90 top
R16  24.83,15.88 0 top
R21  31.53,26.66 180 top
R22  34.35,26.67 0 top
R24  23.59,41.81 180 top
R25  18.84,41.81 180 top
R44  32.77,0.95 180 top
R45  32.77,4.75 180 top
R46  32.77,2.24 180 top
R47  32.77,3.49 180 top
R48  34.77,37.47 270 top
R49  30.48,37.34 270 top
R50  21.75,35.81 180 top
R51  21.97,38.51 180 top
R55  26.48,4.73 180 top
R56  26.48,3.47 180 top
R57  26.48,2.22 180 top
R58  26.48,0.97 180 top
RBG9  15.91,5.27 0 top
RBG10  15.91,12.51 0 top
RBG11  15.91,19.75 0 top
RBG12  15.91,26.99 0 top
RCM9  15.88,6.83 0 top
RCM10  15.88,13.94 0 top
RCM11  15.88,21.18 0 top
RCM12  15.88,28.42 0 top
RGQ1_5  27.84,19.56 180 top
RGQ1_6  32.38,16.57 180 top
RP9  13.56,2.51 0 top
RP10  13.56,9.62 0 top
RP11  13.56,16.86 0 top
RP12  13.56,24.1 0 top
S2  30.26,23.84 270 top
U7  35.43,11.18 0 top
V+R1  21.34,22.03 270 top
Y2  20.8,30.99 270 top

### Tracks (layer width: path | path; a pad name or v marks a point on that pad's centre or on a via)
BAL9
  Top 0.203: IC8.25 21.82,5.43 21.21,4.83 19.43,4.83 18.67,5.59 16.97,5.59 RBG9.2
BAL10
  Top 0.203: IC8.23 20.43,6.62 19.68,7.37 19.68,12.32 19.18,12.83 16.97,12.83 RBG10.2
BAL11
  Top 0.203: RBG11.2 16.66,19.83 17.02,20.19 18.67,20.19 21.32,17.55 IC8.21
BAL12
  Top 0.203: RBG12.2 16.85,27.18 18.92,27.18 19.81,26.29 19.81,20.57 22.32,18.07 IC8.19
C8
  Top 0.203: IC8.26 22.32,5.3 21.34,4.32 18.62,4.32 DCM9.A | H_V-R.1 17.97,3.3
  Top 0.254: RP9.1 10.76,1.69 11.94,0.51 17.53,0.51 17.97,0.95 17.97,3.3 DCM9.A
  Top 0.813: RP9.1 10.57,2.38 7.37,5.59 7.37,9.84 K4.1
C9
  Top 0.254: RCM9.1 15.12,7.61 13.08,9.65 10.79,9.65 RP10.1
  Top 0.813: RP10.1 10.19,9.62 9.53,10.29 | 9.53,10.29 7.46,12.35 K4.2 | QB9.2 9.68,5.05 9.02,5.71 9.02,9.78 9.53,10.29
C9M
  Top 0.203: IC8.24 21.32,5.57 21.08,5.33 19.8,5.33 DCM9.C
  Top 0.254: RCM9.2 16.96,7.16 DCM9.C 17.97,9.02 | DCM10.A 17.97,9.02 | CCM9.1 18.05,8.93 17.97,9.02
C10
  Top 0.254: RCM10.1 15.12,14.97 13.21,16.89 10.79,16.89 RP11.1
  Top 0.813: RP11.1 8.39,16.86 K4.3 9.14,14.25 9.14,12.7 9.55,12.29 QB10.2
C10M
  Top 0.203: DCM10.C 20.24,14.4 IC8.22
  Top 0.254: RCM10.2 17.09,14.4 DCM10.C 17.97,16.13 | DCM11.A 17.97,16.13 | CCM10.1 18.01,16.17 17.97,16.13
C11
  Top 0.254: RCM11.1 15.12,22.21 13.21,24.13 10.79,24.13 RP12.1
  Top 0.813: QB11.2 9.02,19.53 | 9.02,19.53 8.06,19.53 K4.4 | RP12.1 9.49,24.1 9.14,23.75 9.14,19.66 9.02,19.53
C11M
  Top 0.203: DCM11.C 18.11,21.52 21.82,17.81 IC8.20
  Top 0.254: RCM11.2 17.09,21.64 DCM11.C 17.97,23.11 | 17.97,23.11 DCM12.A | CCM11.1 18.01,23.16 17.97,23.11
C12  (via drill 0.3)
  Top 0.203: L5.1 21.37,26.46 v22.25,26.47
  Top 0.254: RCM12.1 15.12,28.56 14.1,29.59 v13.34,29.59 9.65,29.59 9.4,29.34 9.4,27.12 9.75,26.77
  Top 0.813: QB12.2 9.75,26.77 7.49,24.51 7.49,21.96 K4.5
  Bottom 0.203: v22.25,26.47 16.46,26.47 v13.34,29.59
C12M
  Top 0.203: DCM12.C 18.11,28.63 20.32,26.42 20.32,20.83 22.82,18.33 IC8.18 22.82,12.62 23.11,12.32 23.75,12.32 | 23.75,12.32 24.77,12.32 | 24.77,12.32 25.78,12.32 | 25.78,12.32 26.8,12.32 | 26.8,12.32 27.81,12.32 | 27.81,12.32 28.83,12.32 | 28.83,12.32 29.84,12.32 | 29.84,12.32 30.61,12.32 30.82,12.53 IC8.2 | IC8.4 29.82,12.35 29.84,12.32 | IC8.6 28.82,12.33 28.83,12.32 | IC8.8 27.82,12.32 27.81,12.32 | IC8.10 26.82,12.34 26.8,12.32 | IC8.12 25.82,12.36 25.78,12.32 | IC8.14 24.82,12.37 24.77,12.32 | IC8.16 23.82,12.39 23.75,12.32
  Top 0.254: RCM12.2 16.96,28.75 DCM12.C 17.97,29.71 CCM12.1
CANH  (via drill 0.3)
  Top 0.406: K1.3 37.02,25.72 35.15,23.84 S2.2 | L8.1 24.25,27.04 24.26,27.05 v25.53,27.05 26.67,27.05 27.3,27.69 27.3,30.29 D9.2
  Bottom 0.406: v25.53,27.05 36.43,27.05 K1.3
CANJ
  Top 0.406: S2.1 29.43,23.84 30.78,25.2 R21.2
CANL  (via drill 0.3)
  Top 0.406: R22.2 35.43,26.67 37.02,28.26 K1.2 | L8.3 24.08,29.54 24.13,29.59 v25.53,29.59 26.67,30.73 26.67,31.8 D8.2
  Bottom 0.406: v25.53,29.59 36.89,29.59 K1.2
CANRX_U_H  (via drill 0.3)
  Top 0.203: R49.1 v30.48,38.99 | IC7.19 19.38,37.67 19.81,38.1 19.81,39.5 v20.57,40.26
  Bottom 0.203: v30.48,38.99 30.48,41.27 29.97,41.78 21.84,41.78 20.57,40.51 v20.57,40.26
CANT
  Top 0.406: R21.1 33.59,26.66 R22.1 33.6,28.16 C16.1
CANTX_U_H  (via drill 0.3)
  Top 0.203: R48.1 35.8,38.22 v35.81,38.23 | IC7.20 19.24,38.17 19.43,38.35 19.43,40.26 v19.81,40.64
  Bottom 0.203: v35.81,38.23 35.81,41.15 34.8,42.16 21.34,42.16 v19.81,40.64
CAR+5V
  Top 0.406: IC1.1 39.02,6.13 38.61,5.71 C1.1 C5.1 37.2,8.76 37.2,9.54 36.86,9.88 U7.3 | U7.1 34.48,8.95 34.67,8.76 37.08,8.76
  Top 0.61: 37.08,8.76 37.2,8.76
CAR+5V_H
  Top 0.406: IC4.3 31.97,37.64 C6.1 31.89,39 L3.1
CAR+12V
  Top 0.406: L1.2 36.94,18.91 36.96,18.92 36.96,23.39 K1.4
CAR+12VFILT
  Top 0.406: L1.1 38.68,16.91 C3.1 IC1.8
CR9
  Top 0.813: RP9.2 14.64,2.51 12.83,4.32 12.83,5.98 QB9.3
CR10
  Top 0.813: RP10.2 14.76,9.62 12.83,11.56 12.83,13.22 QB10.3
CR11
  Top 0.813: RP11.2 14.89,16.86 12.83,18.92 12.83,20.46 QB11.3
CR12
  Top 0.813: RP12.2 14.76,24.1 12.83,26.04 12.83,27.7 QB12.3
H+3V3  (via drill 0.3, 0.3 pad 0.3)
  Top 0.203: IC8.30 24.32,7.81 v24.64,8.13 | v34.04,15.37 32.26,15.37 31.62,16 RGQ1_6.2 31.64,18.54 Q5.1 | NTC_R1.2 9.09,33.45 v8.26,34.29 | JP2.2 29.15,37.4 29.08,37.47 v29.08,38.99 | R9.1 22.5,38.48 R51.1 22.47,38.49 22.48,38.48 v23.88,38.48 | R25.2 18.09,41.34 v17.02,40.26
  Top 0.279: IC7.44 8.59,36.67 C13.1 C33.1 v7.24,35.56 | LED1.A 11.02,30.5 11.05,30.48 v12.06,30.48 | C8.1 15.01,32.17 IC7.8 15.01,34.18 15.37,34.54 15.49,34.54 | C32.1 18.13,33.68 17.27,34.54 15.49,34.54 | 15.49,34.54 v15.37,34.67 | L3.2 33.4,39.08 v33.4,40.01
  Top 0.406: U7.5 34.48,13.77 C46.1 34.68,14.01 34.87,14.2 34.87,15.19 34.9,15.21 C45.1 v34.04,15.37
  pour Route15 (isolate 0.406, rank 6): 0,0 44.16,-0.16 44.16,42.7 0,42.7
H_!RESET  (via drill 0.3)
  Top 0.203: C24.1 12.51,32.43 IC7.3 12.51,34.55 v12.27,34.8 | R9.2 19.88,37.18 v19.86,37.16 | JP2.1 29.15,40.07 27.94,38.86 v25.15,38.86
  Bottom 0.203: v12.27,34.8 12.27,36.52 13.08,37.34 19.68,37.34 v19.86,37.16 19.91,37.21 24,37.21 25.15,38.35 v25.15,38.86
H_AD1  (via drill 0.3)
  Top 0.203: K3.1 7.46,30.26 9.16,31.95 NTC_R1.1 | IC7.33 13.01,40.82 12.7,40.51 11.3,40.51 v10.16,41.66 10.13,41.69 NTC_C1.1
  Bottom 0.203: v10.16,41.66 7.49,41.66 6.35,40.51 6.35,30.57 K3.1
H_ADR  (via drill 0.3)
  Top 0.203: IC7.32 13.51,40.72 v13.84,40.39 | v18.8,40.89 19.59,41.69 R25.1 R24.2
  Bottom 0.203: v18.8,40.89 14.35,40.89 v13.84,40.39
H_CANRX
  Top 0.203: IC4.4 30.7,36.37 R49.2
H_CANTX
  Top 0.203: IC4.1 34.51,36.46 R48.2
H_CSB  (via drill 0.3)
  Top 0.203: R58.1 v31.11,0.97 32,0.97 R44.2 | IC8.44 31.32,7.7 v31.62,8
  Bottom 0.203: v31.62,8 31.62,1.48 v31.11,0.97
H_FSM  (via drill 0.3)
  Top 0.203: CFSM1.2 20.13,3.49 20.45,3.81 21.97,3.81 23.82,5.66 IC8.29 23.82,8.7 v23.88,8.76 | R16.2 v26.54,15.88 R10.1
  Bottom 0.203: v26.54,15.88 26.54,11.43 v23.88,8.76
H_ISP_CAN
  Top 0.203: IC7.14 20.35,35.17 R50.2
H_ISP_ENTER  (via drill 0.3)
  Top 0.203: v20.45,38.1 20.83,38.1 21.22,38.49 R51.2 21.21,38.52 21.21,39.5 22.23,40.52 26.42,40.52 26.67,40.77 JP2.5 | IC7.4 13.01,38.02 v13.08,38.1
  Bottom 0.203: v20.45,38.1 v13.08,38.1
H_LED
  Top 0.203: R8.1 10.61,34.47 10.42,34.67 IC7.48
H_MISO  (via drill 0.3)
  Top 0.203: R46.1 33.52,2.27 33.53,2.29 v34.54,2.29 | IC7.26 16.51,40.89 16.38,40.77 16.38,35.31 v16.51,35.18
  Bottom 0.203: v34.54,2.29 33.27,2.29 32.64,2.92 32.64,17.53 23.62,26.54 23.62,30.35 19.3,34.67 17.02,34.67 v16.51,35.18
H_MOSI  (via drill 0.3)
  Top 0.203: R47.1 33.52,3.54 33.53,3.56 v34.54,3.56 | IC7.38 10.71,39.67 10.92,39.88 12.83,39.88 13.84,38.86 v13.84,35.81
  Bottom 0.203: v34.54,3.56 33.4,3.56 33.02,3.94 33.02,17.78 24,26.8 24,30.61 18.8,35.81 v13.84,35.81
H_SCK  (via drill 0.3)
  Top 0.203: R55.1 v29.46,4.73 32,4.73 R45.2 | IC8.41 29.82,7.78 v29.46,8.13
  Bottom 0.203: v29.46,8.13 v29.46,4.73
H_SCK1  (via drill 0.3)
  Top 0.203: R45.1 33.52,4.71 33.53,4.7 v34.54,4.7 | IC7.13 22.86,34.67 v22.99,34.8
  Bottom 0.203: v34.54,4.7 33.66,4.7 33.4,4.95 33.4,18.03 24.38,27.05 24.38,33.4 v22.99,34.8
H_SDI  (via drill 0.3)
  Top 0.203: R56.1 v30.23,3.47 32,3.47 R47.2 | IC8.42 30.32,8.54 v29.97,8.89
  Bottom 0.203: v29.97,8.89 30.23,8.64 v30.23,3.47
H_SDO  (via drill 0.3)
  Top 0.203: R57.1 v30.99,2.22 32,2.22 R46.2 | IC8.43 30.82,8.59 v31.11,8.89
  Bottom 0.203: v31.11,8.89 30.99,8.76 v30.99,2.22
H_SSEL  (via drill 0.3)
  Top 0.203: R44.1 33.59,0.95 33.66,0.89 v34.54,0.89 | IC7.2 12.01,33.97 v11.43,34.54
  Bottom 0.203: v34.54,0.89 33.15,0.89 32.26,1.78 32.26,17.27 23.24,26.29 23.24,30.23 19.43,34.04 11.94,34.04 v11.43,34.54
H_SWCLK  (via drill 0.3)
  Top 0.203: JP2.4 27.88,35.62 27.56,35.31 v24.77,35.31 | IC7.29 15.01,36.47 v14.99,36.45
  Bottom 0.203: v24.77,35.31 24.77,35.81 24.13,36.45 v14.99,36.45
H_SWDIO  (via drill 0.3)
  Top 0.203: JP2.3 27.88,39.69 27.43,39.24 25.78,39.24 v25.27,39.75 | IC7.39 11.99,39.17 v12.06,39.24
  Bottom 0.203: v25.27,39.75 25.02,39.5 12.32,39.5 v12.06,39.24
H_V+
  Top 0.203: D3.C 26.02,18.02 26.42,18.41 | 26.42,18.41 28.96,18.41 29.32,18.05 C35.1 29.29,17.28 R10.2 30.61,15.88 31.32,15.16 IC8.1 | Q6.3 25.04,19.79 26.42,18.41
H_VREF
  Top 0.203: IC8.31 24.82,5.77 22.35,3.3 21.72,3.3 21.4,2.98 CVREF1.2
H_VREG
  Top 0.203: IC8.32 25.32,5.63 22.7,3.02 CVREG1.2 22.94,2.22 R57.2 | R58.2 R57.2 | R57.2 R56.2 R55.2
HCANHL
  Top 0.406: L8.5 29.2,27.04 29.84,27.69 31.62,27.69 33.15,29.21 33.15,29.74 IC4.7
HCANLL
  Top 0.406: L8.4 28.88,29.54 29.97,28.45 31.5,28.45 32,28.96 32,29.8 IC4.6
HGND  (via drill 0.3)
  Top 0.203: IC8.27 v22.82,8.13 | IC8.33 IC8.34 IC8.35 IC8.36 IC8.37 | IC8.37 v27.82,8.13 | IC8.40 IC8.39 IC8.38 IC8.37 | H_V-R.2 v18.8,0.76 19,0.96 CFSM1.1 CVREF1.1 CVREG1.1 | Q5.2 33.13,18.54 RGQ1_6.1 33.13,16.62 33.15,16.64 v34.16,16.64 | JP2.6 26.61,36.13 26.54,36.07 v25.53,36.07 | IC7.41 v11.18,38.17 | v13.63,34.67 13.61,34.65 13.51,34.54 IC7.5 13.51,31.93 C24.2 | C31.1 21.58,27.93 21.59,27.94 v22.61,27.94 | C25.1 21.45,33.9 21.46,33.91 v22.61,33.91 | R12.2 35.67,41.51 35.69,41.53 v36.96,41.53 | NTC_C1.2 7.53,41.69 7.49,41.66 v6.6,41.66 | R50.1 v23.37,35.81 | R24.1 24.86,41.81 v25.53,41.15
  Top 0.254: CCM9.2 v18.8,11.56 | CCM10.2 v18.8,18.8 | CCM11.2 v18.8,25.65 | CCM12.2 v15.24,29.72
  Top 0.279: C32.2 18.24,32.21 19.18,33.15 v19.18,33.4 | IC7.41 8.68,38.17 C13.2 C33.2
  Top 0.305: R16.1 23.82,16.14 D3.A 23.79,17.57 23.75,17.53 v23.75,18.54 | C35.2 27.72,17.3 27.18,16.76 v26.67,16.76 | C45.2 v37.59,15.37 | C46.2 v37.21,13.97 | C8.2 17.74,31.69 C32.2
  Top 0.406: C3.2 41.78,17.27 v41.78,18.92 | C5.2 v34.54,7.49 | C1.2 v34.54,5.71 | C16.2 35.13,28.15 35.43,28.19 v35.43,30.48 | C6.2 33.24,37.57 IC4.2 33.24,35.21 33.27,35.18 v33.27,33.91 33.15,33.78 29.46,33.78 28.99,34.26 D9.1 D8.1
  other vias: 40.01,10.92 41.91,10.92 40.89,10.92 40.89,12.83 40.01,12.83 41.91,12.83 35.43,11.18 34.67,11.18 36.2,11.18
  pour Route2 (isolate 0.406, rank 6): 0,0 44.16,-0.16 44.16,42.7 0,42.7
  pour Top (no thermals): 39.75,15.75 39.75,7.87 42.16,7.87 42.16,15.75
  pour Bottom: 38.1,7.87 43.69,7.87 43.69,15.75 38.1,15.75
  pour Top (no thermals): 34.92,9.27 34.92,10.54 34.8,10.67 33.78,10.67 33.66,10.79 33.66,11.56 33.78,11.68 37.08,11.68 37.21,11.56 37.21,10.79 37.08,10.67 36.07,10.67 35.94,10.54 35.94,9.27
LED1C1
  Top 0.203: LED1.C R8.2
N$5
  Top 0.203: RGQ1_5.1 30.1,19.56 30.86,20.32 32.26,20.32 32.38,20.45 Q5.3
N$6
  Top 0.203: L5.2 21.37,22.82 V+R1.1
Q1G1
  Top 0.203: Q6.1 24.89,20.96 26.29,19.56 RGQ1_5.2
QBG9
  Top 0.254: QB9.1 13.88,6.95 14.22,6.6 14.22,5.46 14.41,5.27 RBG9.1
QBG10
  Top 0.254: QB10.1 13.88,14.19 14.22,13.84 14.22,12.83 14.54,12.51 RBG10.1
QBG11
  Top 0.254: QB11.1 13.75,21.43 14.1,21.08 14.1,20.07 14.41,19.75 RBG11.1
QBG12
  Top 0.254: QB12.1 13.75,28.67 14.1,28.32 14.1,27.3 14.48,26.92 15.09,26.92 RBG12.1
RS  (via drill 0.3)
  Top 0.203: IC4.8 34.51,30.19 34.54,30.23 v34.54,31.75 | R12.1 36.83,40.01 v36.96,39.88
  Bottom 0.203: v34.54,31.75 34.54,33.78 36.96,36.2 v36.96,39.88
V+S1
  Top 0.203: V+R1.2 22.28,21.29 Q6.2
XTALIN1
  Top 0.203: IC7.6 14.01,30.82 14.35,30.48 18.41,30.48 18.8,30.1 18.8,29.08 19.18,28.7 20.07,28.7 21.34,28.7 21.46,28.83 21.46,29.88 Y2.2
  Top 0.305: C31.2 20.08,28.69 20.07,28.7
XTALOUT1
  Top 0.203: IC7.7 14.51,31.21 14.86,30.86 18.81,30.86 Y2.1 20,33.76 C25.2

### Text on the board
Bottom: canSlaveV03_12s / (C) David Brandt / david@wakka.de